# EAGLE design minisumo_v2 (EAGLE 9.4.2)
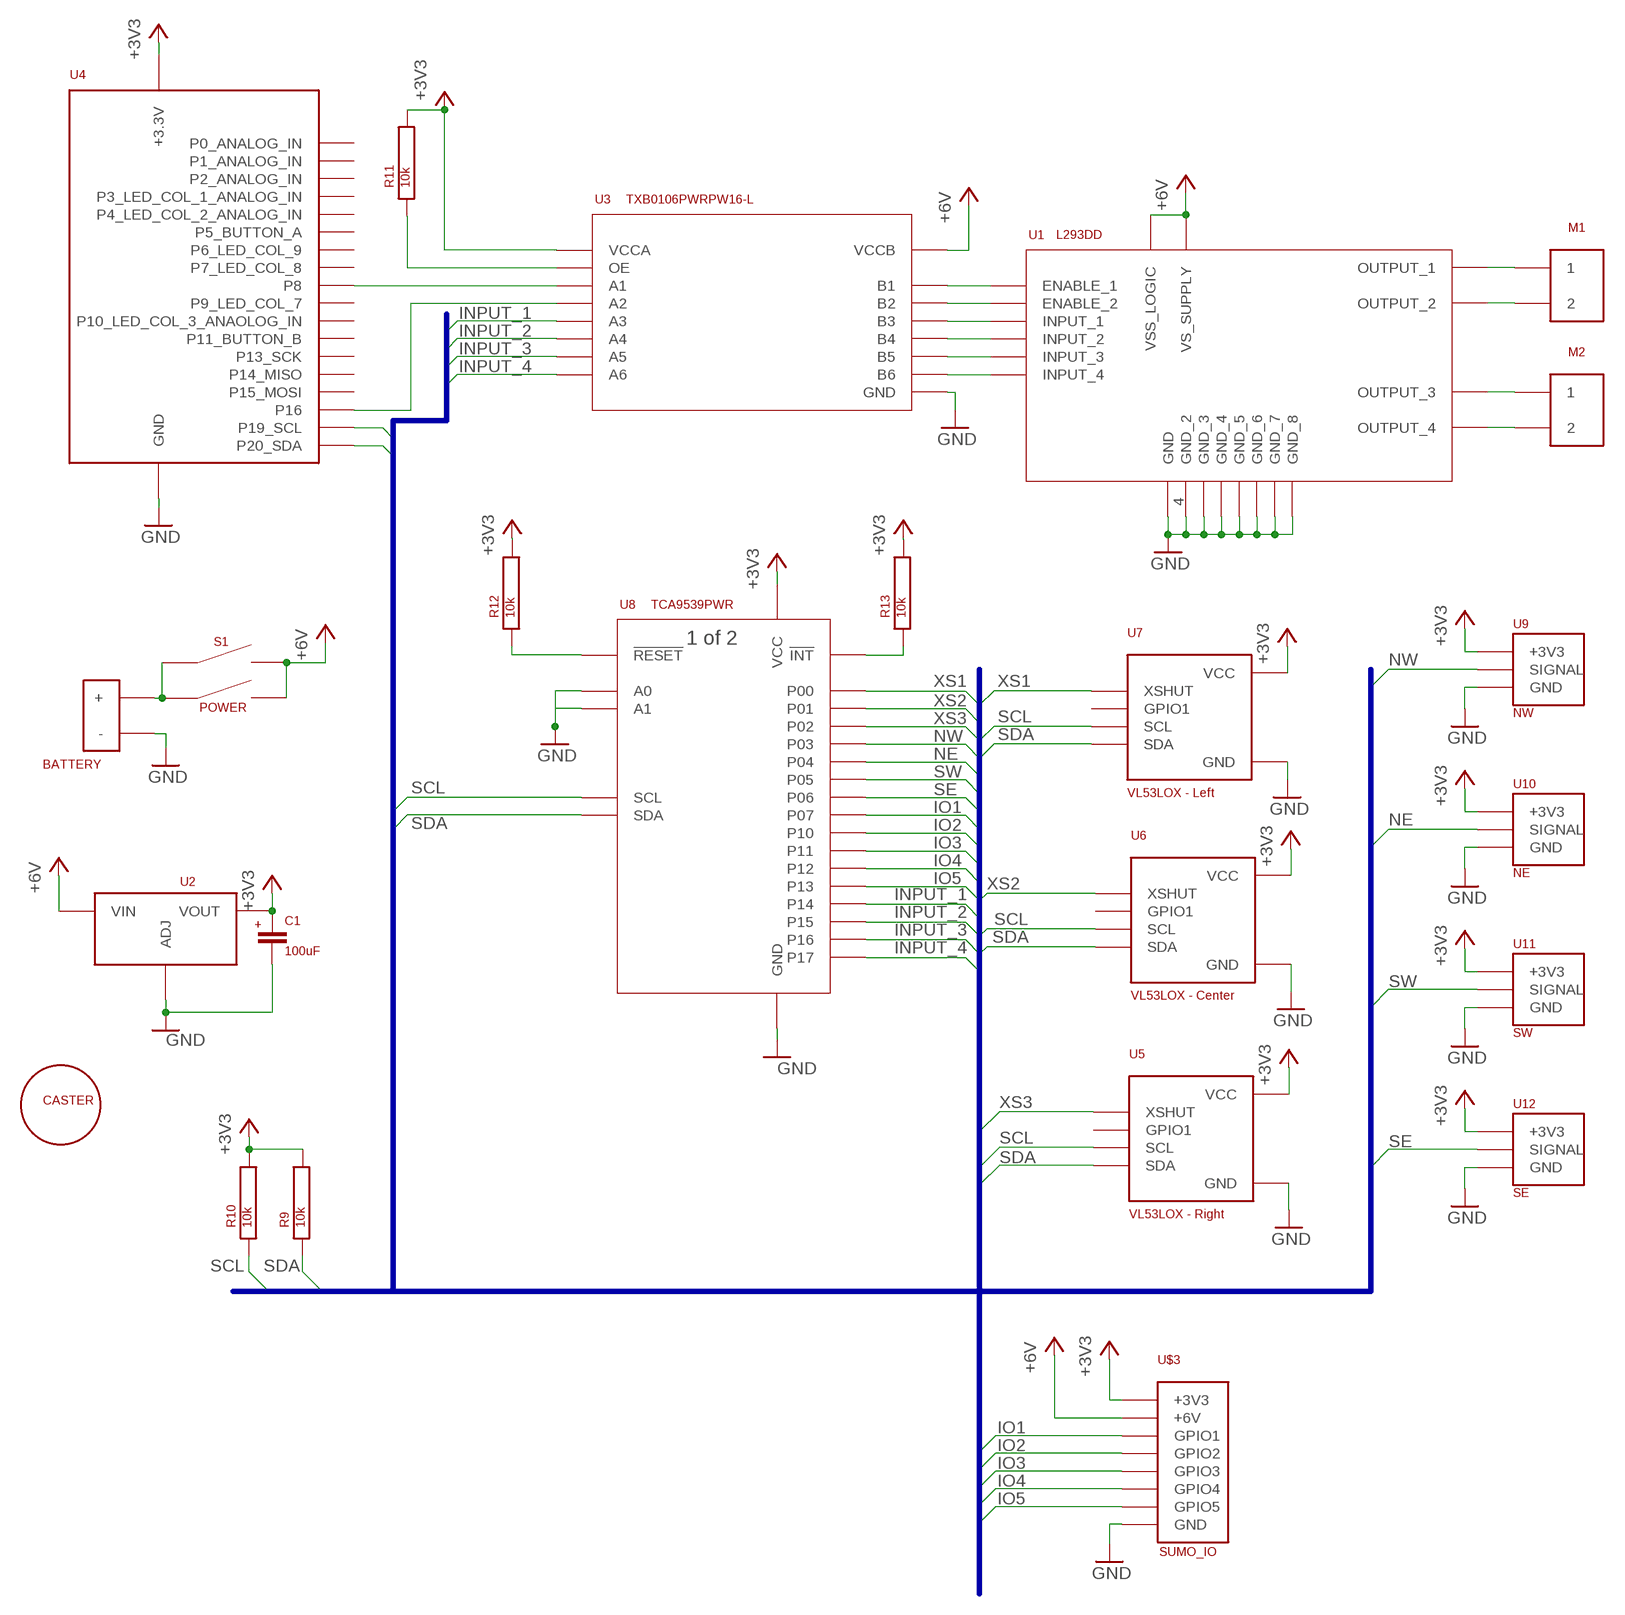
[diagram p0: schematic, sheet 1]

## Parts
BATTERY  BATTERY_HOLDER_AAA_2X2  [BATTERY_HOLDER_AAA_2X2]
C1  100uF  ELECTROLYTIC_CAPACITORWURTH_100  [ALUMINUM_WURTH_100UF_865080243007]
M1  N20_MOTOR  [N20-MOTOR-BRACKET]
M2  N20_MOTOR  [N20-MOTOR-BRACKET]
R9  10k  RESISTOR  [RES_0402]
R10  10k  RESISTOR  [RES_0402]
R11  10k  RESISTOR  [RES_0402]
R12  10k  RESISTOR  [RES_0402]
R13  10k  RESISTOR  [RES_0402]
S1  POWER  SWITCH_JS202011SCQN  [SWITCH_JS202011SCQN]
U1  L293DD  [SO-20]
U2  LM1117  [SOT-223]
U3  TXB0106PWRPW16-L  [PW16-L]
U4  BBC Micro:bit  MICRO_BIT  [CYCLONE_MICROBIT_VERTICAL]
U5  VL53LOX - Right  VL53LOX  [VL53LOX]
U6  VL53LOX - Center  VL53LOX  [VL53LOX]
U7  VL53LOX - Left  VL53LOX  [VL53LOX]
U8  TCA9539PWR  [24-TSSOP]
U9  NW  QRE1113_MODULE  [QRE1113_MODULE]
U10  NE  QRE1113_MODULE  [QRE1113_MODULE]
U11  SW  QRE1113_MODULE  [QRE1113_MODULE]
U12  SE  QRE1113_MODULE  [QRE1113_MODULE]
U$1  CASTER  [CASTER]
U$3  SUMO_IO  [SUMO_IO]

## Nets
+3V3: C1.+ R9.P$2 R10.P$2 R11.P$2 R12.P$2 R13.P$2 U2.P$2(VOUT) U2.VOUT$1(VOUT) U3.2(VCCA) U4.3.3V@9(+3.3V) U4.3.3V@10(+3.3V) U4.3.3V@11(+3.3V) U4.3.3V@12(+3.3V) U4.3.3V@13(+3.3V) U4.3.3V@14(+3.3V) U5.VCC U6.VCC U7.VCC U8.24(VCC) U9.+3V3 U10.+3V3 U11.+3V3 U12.+3V3 U$3.3V3(+3V3)
+5V: S1.3(B2) S1.6(B1) U1.10(VS_SUPPLY) U1.20(VSS_LOGIC) U2.VIN U3.15(VCCB) U$3.6V(+6V) ; supply symbol labelled +6V
GND: BATTERY.- C1.- U1.4(GND_2) U1.5(GND_3) U1.6(GND_4) U1.7(GND_5) U1.14(GND_6) U1.15(GND_7) U1.16(GND_8) U1.17(GND) U2.GND(ADJ) U3.9(GND) U4.GND@1(GND) U4.GND@2(GND) U4.GND@3(GND) U4.GND@4(GND) U4.GND@5(GND) U4.GND@6(GND) U5.GND U6.GND U7.GND U8.2(A1) U8.12(GND) U8.21(A0) U9.GND U10.GND U11.GND U12.GND U$3.GND
INPUT_1: U3.4(A3) U8.17(P14)
INPUT_2: U3.5(A4) U8.18(P15)
INPUT_3: U3.6(A5) U8.19(P16)
INPUT_4: U3.7(A6) U8.20(P17)
IO1: U8.11(P07) U$3.GPIO1
IO2: U8.13(P10) U$3.GPIO2
IO3: U8.14(P11) U$3.GPIO3
IO4: U8.15(P12) U$3.GPIO4
IO5: U8.16(P13) U$3.GPIO5
N$1: U1.1(ENABLE_1) U3.16(B1)
N$2: U1.11(ENABLE_2) U3.14(B2)
N$3: U1.2(INPUT_1) U3.13(B3)
N$4: U1.9(INPUT_2) U3.12(B4)
N$5: M1.1 U1.3(OUTPUT_1)
N$6: M1.2 U1.8(OUTPUT_2)
N$7: M2.1 U1.13(OUTPUT_3)
N$8: M2.2 U1.18(OUTPUT_4)
N$9: U3.1(A1) U4.P8
N$10: U1.12(INPUT_3) U3.11(B5)
N$11: U3.3(A2) U4.P16
N$12: U1.19(INPUT_4) U3.10(B6)
N$13: BATTERY.+ S1.2(A2) S1.5(A1)
N$14: R11.P$1 U3.8(OE)
N$16: R12.P$1 U8.3(!RESET)
N$17: R13.P$1 U8.1(!INT)
NE: U8.8(P04) U10.SIGNAL
NW: U8.7(P03) U9.SIGNAL
SCL: R10.P$1 U4.P21_SCL(P19_SCL) U5.SCL U6.SCL U7.SCL U8.22(SCL)
SDA: R9.P$1 U4.P20_SDA U5.SDA U6.SDA U7.SDA U8.23(SDA)
SE: U8.10(P06) U12.SIGNAL
SW: U8.9(P05) U11.SIGNAL
XS1: U7.XSHUT U8.4(P00)
XS2: U6.XSHUT U8.5(P01)
XS3: U5.XSHUT U8.6(P02)
Unconnected: U4.P0_ANALOG_IN@36(P0_ANALOG_IN) U4.P0_ANALOG_IN@37(P0_ANALOG_IN) U4.P0_ANALOG_IN@38(P0_ANALOG_IN) U4.P0_ANALOG_IN@39(P0_ANALOG_IN) U4.P1_ANALOG_IN@28(P1_ANALOG_IN) U4.P1_ANALOG_IN@29(P1_ANALOG_IN) U4.P1_ANALOG_IN@30(P1_ANALOG_IN) U4.P1_ANALOG_IN@31(P1_ANALOG_IN) U4.P2_ANALOG_IN@19(P2_ANALOG_IN) U4.P2_ANALOG_IN@20(P2_ANALOG_IN) U4.P2_ANALOG_IN@21(P2_ANALOG_IN) U4.P2_ANALOG_IN@22(P2_ANALOG_IN) U4.P3_LED_COL_1_ANALOG_IN U4.P4_LED_COL_2_ANALOG_IN U4.P5_BUTTON_A U4.P6_LED_COL_9 U4.P7_LED_COL8(P7_LED_COL_8) U4.P9_LED_COL_7 U4.P10_LED_COL_3_ANALOG_IN(P10_LED_COL_3_ANAOLOG_IN) U4.P11_BUTTON_B U4.P13_SCK U4.P14_MISO U4.P15_MOSI U5.GPIO1 U6.GPIO1 U7.GPIO1

## Buses
INPUT_1,INPUT_2,INPUT_3,INPUT_4,IO1,IO2,IO3,IO4,IO5,NE,NW,SCL,SDA,SE,SW,XS1,XS2,XS3

## Library data of the parts
BATTERY = TimeExpander2:BATTERY_HOLDER_AAA_2X2
C1 = TimeExpander2:ELECTROLYTIC_CAPACITOR
M1 M2 = TimeExpander2:N20_MOTOR
R9-R13 = TimeExpander2:RESISTOR
S1 = TimeExpander2:SWITCH_JS202011SCQN
U1 = TimeExpander2:L293DD; MANUFACTURER_PART_NUMBER: L293DD; VENDOR: STMicroelectronics
U2 = EE_copy:LM1117
U3 = TimeExpander2:TXB0106PWR; MANUFACTURER_PART_NUMBER: TXB0106PWR; VENDOR: Texas Instruments
U4 = TimeExpander2:MICRO_BIT
U5-U7 = TimeExpander2:VL53LOX
U8 = TimeExpander2:TCA9539PWR
U9-U12 = TimeExpander2:QRE1113_MODULE
U$1 = TimeExpander2:CASTER
U$3 = TimeExpander2:SUMO_IO

## Board
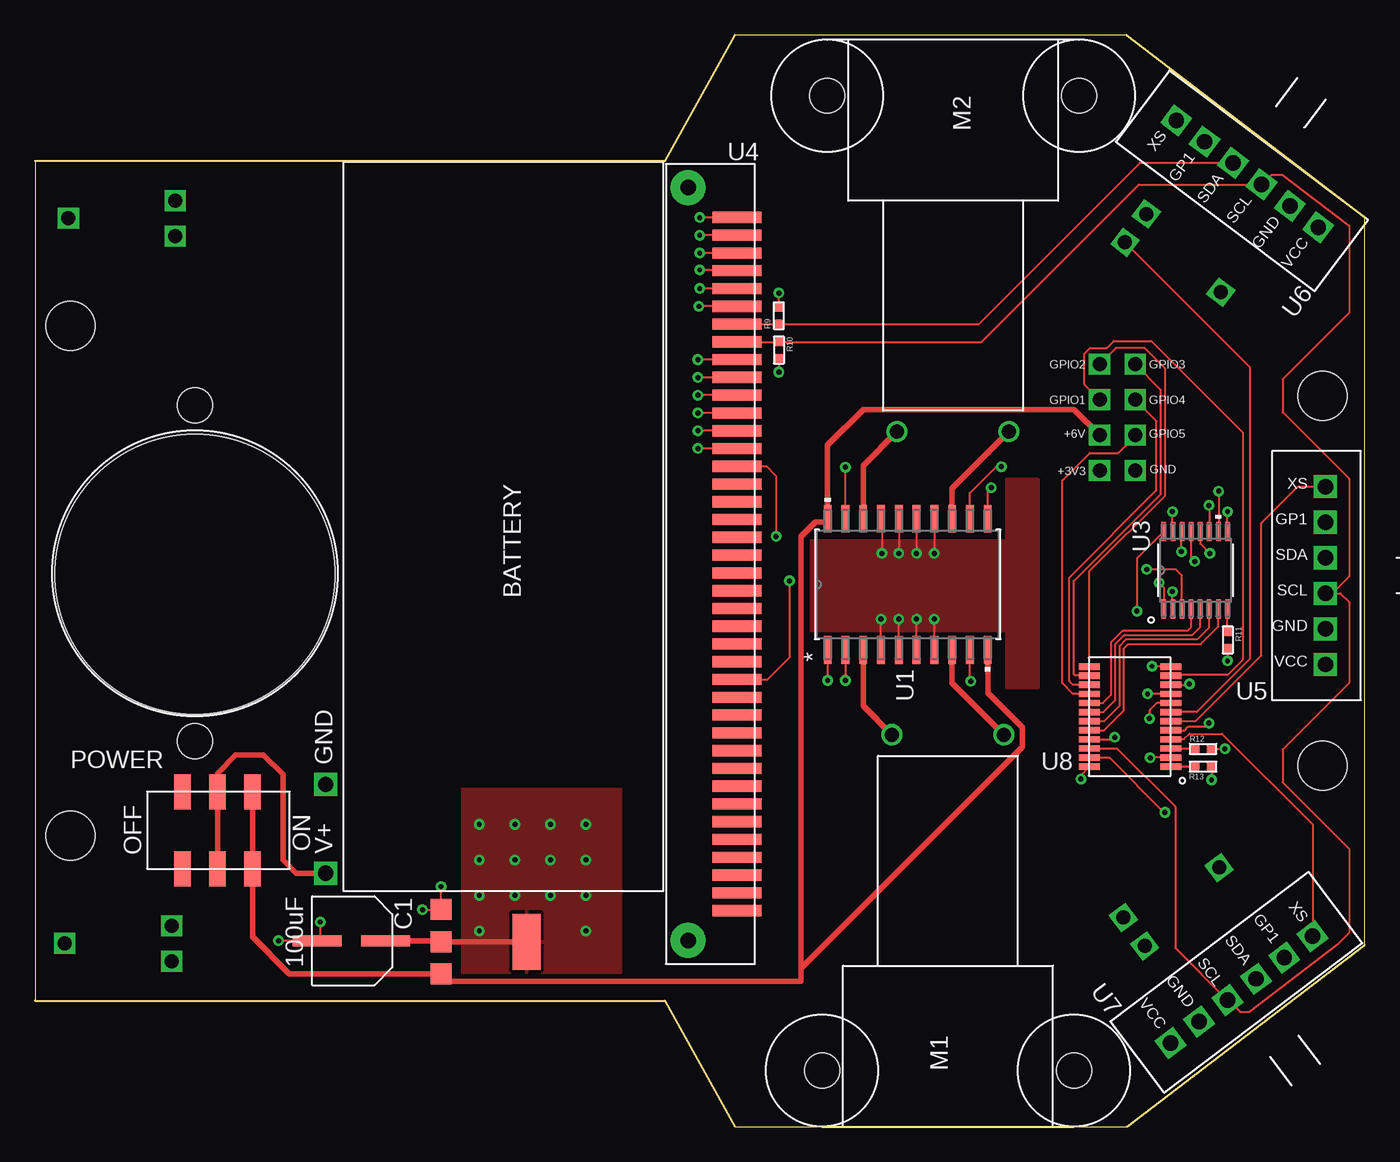
[diagram p1: board, top side]
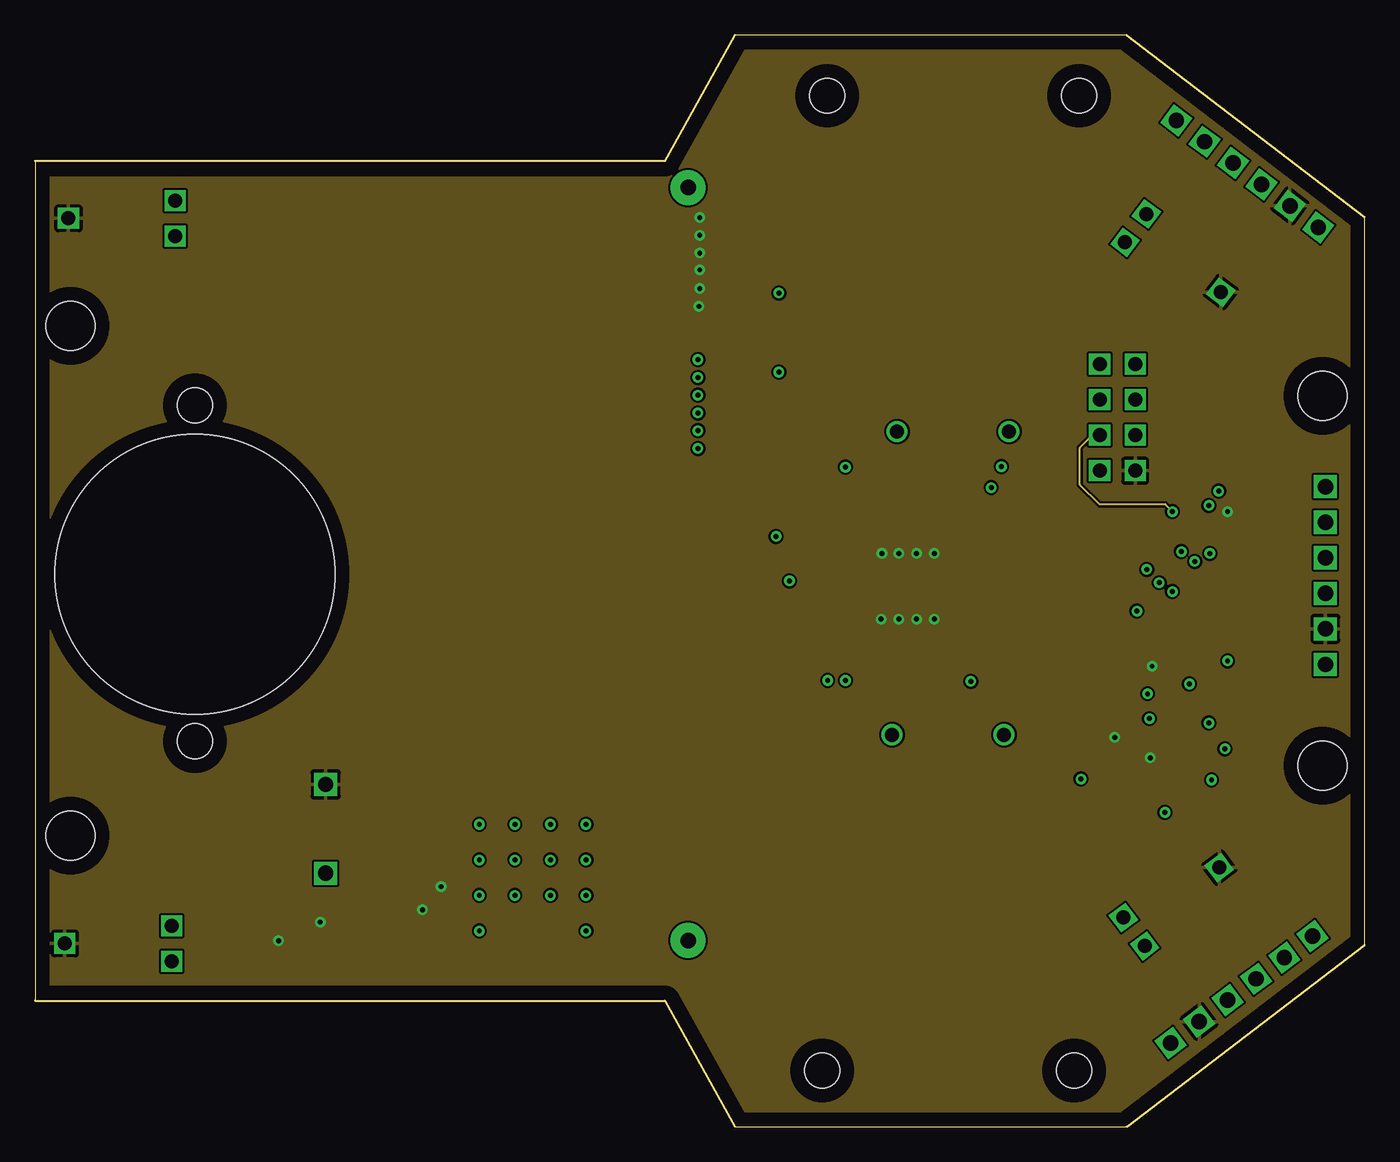
[diagram p2: board, inner layer L2_GND]
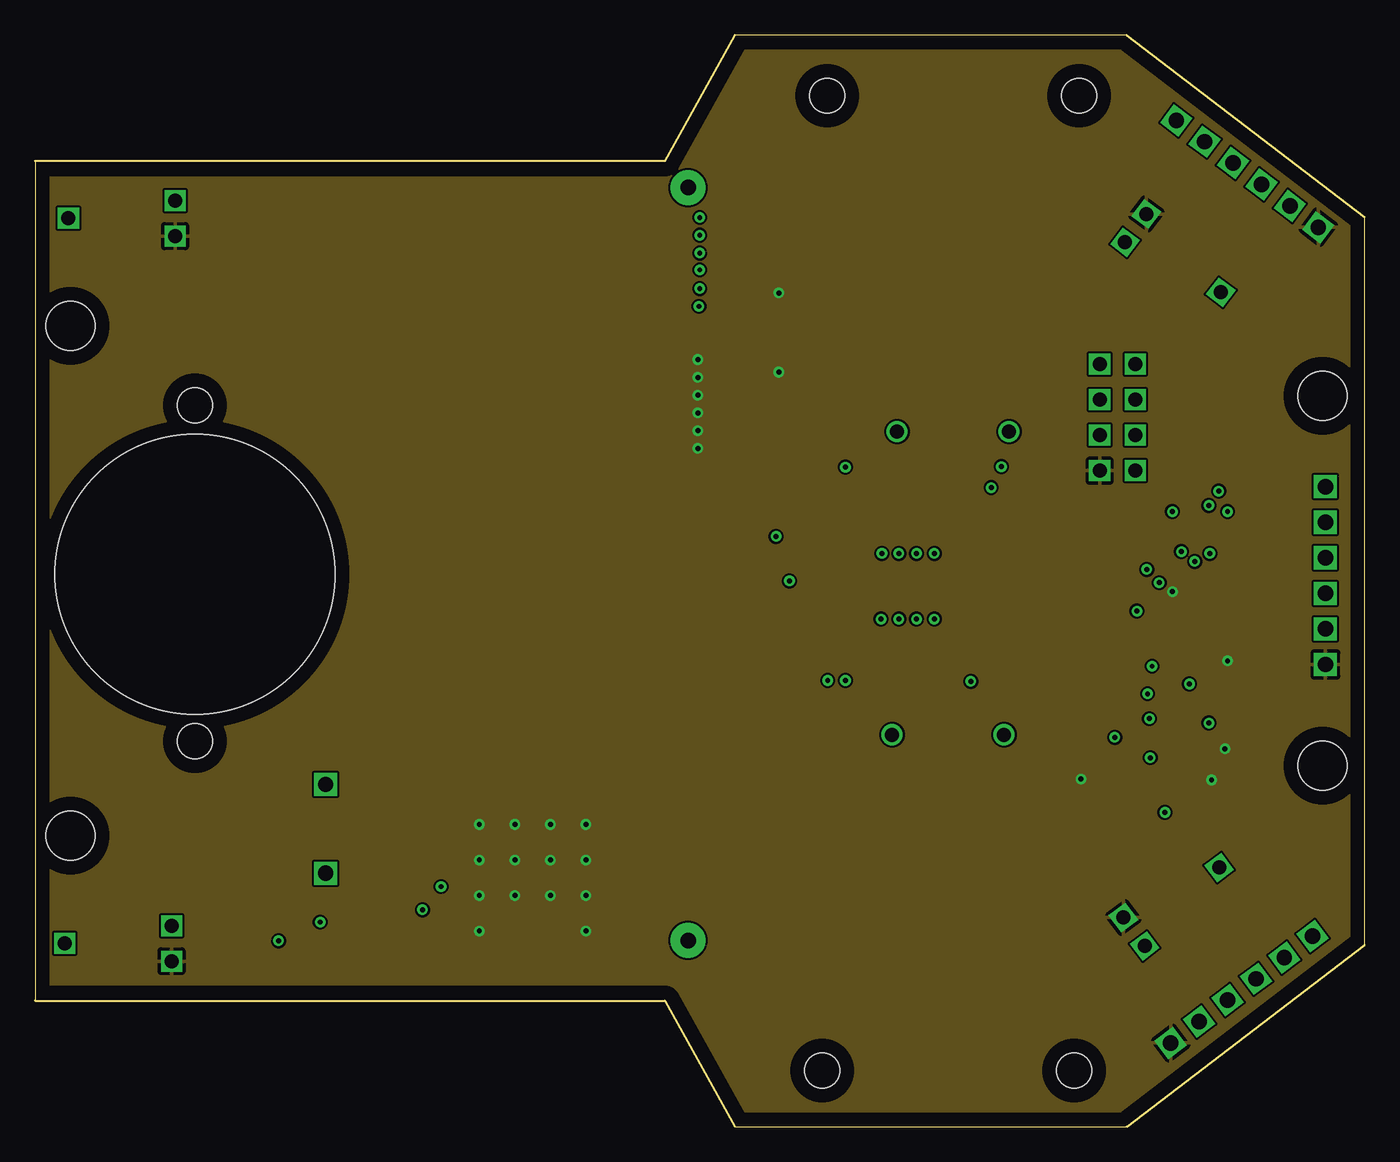
[diagram p3: board, inner layer L3_3V3]
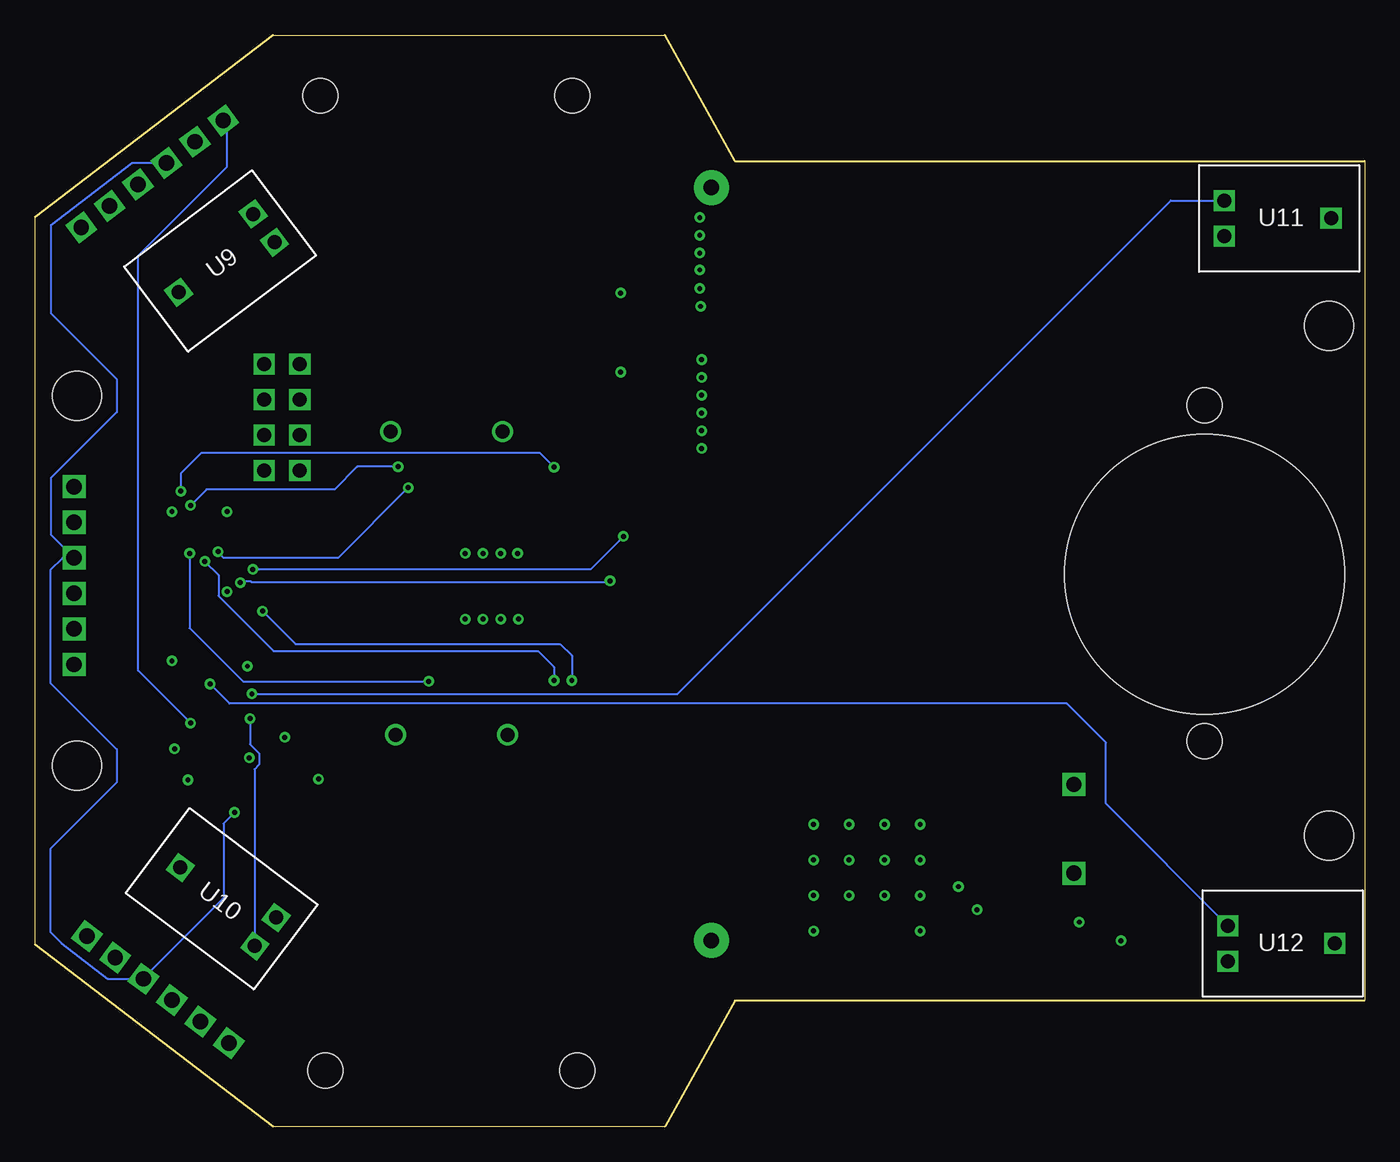
[diagram p4: board, bottom side, seen from below]

Size 95 x 78 mm. Coordinates in mm from the lower left corner, seen from the top.
Outline: 50,0 78,0 95,13 95,65 78,78 50,78 45,69 0,69 0,9 45,9 50,0
Copper layers (1+2*15+16): L1_TOP 0.035mm / dielectric 0.2mm / L2_GND 0.035mm / dielectric 0.15mm / L3_3V3 0.035mm / dielectric 0.2mm / L4_BOTTOM 0.035mm
Design rules "default *": minimum track width 6mil, minimum drill 0.35mm, track to track 6mil, track to pad 6mil, pad to pad 6mil, via to via 6mil, smd to smd 6mil, copper to edge 40mil, drill to drill 6mil, minimum pad ring 10mil, minimum via ring 8mil, stop-mask expansion 4mil, vias tented up to drill 15mil, thermal gap 10mil
Holes 3.5 mm at 2.54,57.22 2.54,20.78 92,52.22 92,25.78

### Footprints (pad centres in the part's own frame; a part is rotated, then mirrored left to right if it is on the bottom)
BATTERY_HOLDER_AAA_2X2 = drill 1.1 square: + 1.27,24.13; - 7.62,24.13
ALUMINUM_WURTH_100UF_865080243007 = smd 0.8 x 3.5: + 0,0.8; - 0,-4.1
N20-MOTOR-BRACKET = drill 1: 1 24,-5; 2 24,-13 | hole 2.5: 0,0; 0,-18
RES_0402 = smd 0.635 x 0.61: P$1 0,0; P$2 1.194,0
SWITCH_JS202011SCQN = smd 2.5 x 1.2: 1 0,0; 2 0,-2.5; 3 0,-5; 4 5.5,0; 5 5.5,-2.5; 6 5.5,-5
SO-20 = smd 1.981 x 0.559: 1 -4.686,5.715; 2 -4.686,4.445; 3 -4.686,3.175; 4 -4.686,1.905; 5 -4.686,0.635; 6 -4.686,-0.635; 7 -4.686,-1.905; 8 -4.686,-3.175; 9 -4.686,-4.445; 10 -4.686,-5.715; 11 4.686,-5.715; 12 4.686,-4.445; 13 4.686,-3.175; 14 4.686,-1.905; 15 4.686,-0.635; 16 4.686,0.635; 17 4.686,1.905; 18 4.686,3.175; 19 4.686,4.445; 20 4.686,5.715
SOT-223 = smd 1.5 x 1.5: GND -2.3,-6.1; P$2 0,-6.1; VIN 2.3,-6.1 | smd 4 x 2: VOUT$1 0,0
PW16-L = smd 1.365 x 0.325: 1 -2.769,2.275; 2 -2.769,1.625; 3 -2.769,0.975; 4 -2.769,0.325; 5 -2.769,-0.325; 6 -2.769,-0.975; 7 -2.769,-1.625; 8 -2.769,-2.275; 9 2.769,-2.275; 10 2.769,-1.625; 11 2.769,-0.975; 12 2.769,-0.325; 13 2.769,0.325; 14 2.769,0.975; 15 2.769,1.625; 16 2.769,2.275
CYCLONE_MICROBIT_VERTICAL = drill 1.1 pad 2.5: 1 -2.135,-3.5; 2 51.665,-3.5 | smd 0.8 x 3.5: 3.3V@9 10.16,0; 3.3V@10 11.43,0; 3.3V@11 12.7,0; 3.3V@12 13.97,0; 3.3V@13 15.24,0; 3.3V@14 16.51,0; GND@1 0,0; GND@2 1.27,0; GND@3 2.54,0; GND@4 3.81,0; GND@5 5.08,0; GND@6 6.35,0; P0_ANALOG_IN@36 44.45,0; P0_ANALOG_IN@37 45.72,0; P0_ANALOG_IN@38 46.99,0; P0_ANALOG_IN@39 48.26,0; P1_ANALOG_IN@28 34.29,0; P1_ANALOG_IN@29 35.56,0; P1_ANALOG_IN@30 36.83,0; P1_ANALOG_IN@31 38.1,0; P2_ANALOG_IN@19 22.86,0; P2_ANALOG_IN@20 24.13,0; P2_ANALOG_IN@21 25.4,0; P2_ANALOG_IN@22 26.67,0; P3_LED_COL_1_ANALOG_IN 49.53,0; P4_LED_COL_2_ANALOG_IN 43.18,0; P5_BUTTON_A 41.91,0; P6_LED_COL_9 40.64,0; P7_LED_COL8 39.37,0; P8 33.02,0; P9_LED_COL_7 31.75,0; P10_LED_COL_3_ANALOG_IN 30.48,0; P11_BUTTON_B 29.21,0; P13_SCK 21.59,0; P14_MISO 20.32,0; P15_MOSI 19.05,0; P16 17.78,0; P20_SDA 7.62,0; P21_SCL 8.89,0; RESERVED 27.94,0
VL53LOX = drill 1.1 square: GND 0,-2.54; GPIO1 0,-10.16; SCL 0,-5.08; SDA 0,-7.62; VCC 0,0; XSHUT 0,-12.7
24-TSSOP = smd 1.5 x 0.45: 1 0,0; 2 0,-0.65; 3 0,-1.3; 4 0,-1.95; 5 0,-2.6; 6 0,-3.25; 7 0,-3.9; 8 0,-4.55; 9 0,-5.2; 10 0,-5.85; 11 0,-6.5; 12 0,-7.15; 13 5.8,-7.15; 14 5.8,-6.5; 15 5.8,-5.85; 16 5.8,-5.2; 17 5.8,-4.55; 18 5.8,-3.9; 19 5.8,-3.25; 20 5.8,-2.6; 21 5.8,-1.95; 22 5.8,-1.3; 23 5.8,-0.65; 24 5.8,0
QRE1113_MODULE = drill 1 square: +3V3 1.8,2.54; GND 9.42,3.81; SIGNAL 1.8,5.08
CASTER = hole 2.5: 0,2; 0,-22 | hole 20: 0,-10.08
SUMO_IO = drill 1 square: 3V3 0,0; 6V 2.54,0; GND 0,-2.54; GPIO1 5.08,0; GPIO2 7.62,0; GPIO3 7.62,-2.54; GPIO4 5.08,-2.54; GPIO5 2.54,-2.54

### Placement (x,y rotation side)
BATTERY  44.89,16.83 90 top
C1  24.26,13.27 270 top
M1  56.24,4 90 top
M2  74.6,73.66 270 top
R9  53.15,57.34 90 top
R10  53.15,56.07 270 top
R11  85.22,35.37 270 top
R12  82.87,26.99 0 top
R13  82.87,25.72 0 top
S1  10.54,18.41 90 top
U1  62.36,38.73 90 top
U2  35.12,13.21 270 top
U3  82.93,39.75 90 top
U4  50.16,64.96 270 top
U5  92.2,33.02 180 top
U6  91.69,64.26 233 top
U7  81.15,5.97 127 top
U8  81.15,25.72 180 top
U9  79.5,68.33 217 bottom
U10  74.8,15.88 143 bottom
U11  11.81,61.09 0 bottom
U12  11.56,9.27 0 bottom
U$1  11.43,49.53 0 top
U$3  76.07,46.86 90 top

### Tracks (layer width: path | path; a pad name or v marks a point on that pad's centre or on a via)
+3V3  (via drill 0.35)
  L1_TOP 0.152: U3.2 81.28,37.01 v81.28,38.23 | U4.3.3V@9 v47.37,54.8 | U4.3.3V@10 v47.37,53.53 | U4.3.3V@11 v47.37,52.26 | U4.3.3V@12 v47.37,50.99 | U4.3.3V@13 v47.37,49.72 | U4.3.3V@14 v47.37,48.45 | 28.95,13.27 U2.P$2 | R9.P$2 v53.15,59.56 | R10.P$2 v53.15,53.91 | R11.P$2 v85.22,33.27 | R12.P$2 v85.03,26.99 | R13.P$2 84.07,25.7 v84.07,24.77 | U8.24 74.74,25.1 v74.74,24.83
  L1_TOP 0.4: U2.P$2 U2.VOUT$1 | 28.95,13.27 C1.+
  other vias: 31.75,21.59 31.75,19.05 31.75,16.51 31.75,13.97 34.29,21.59 34.29,19.05 34.29,16.51 36.83,21.59 36.83,19.05 36.83,16.51 39.37,21.59 39.37,19.05 39.37,16.51 39.37,13.97
  pour L3_3V3: 0,8.89 45.09,8.89 50.04,-0.13 78.11,0 95,12.95 95,65.15 77.98,77.98 49.91,77.98 44.96,69.09 0.13,68.96
  pour L1_TOP: 30.48,10.99 41.91,10.99 41.91,24.13 30.48,24.13
+5V  (via drill 0.35)
  L1_TOP 0.152: U2.VIN 29.54,10.38 | U1.20 56.4,43.18 | U3.15 81.28,42.55 v81.28,43.94 | 54.74,10.38 54.61,10.38 | 54.74,11.43 54.74,11.37
  L1_TOP 0.4: S1.6 S1.3 15.54,13.54 18.18,10.91 U2.VIN | 29.54,10.38 54.61,10.38 | U1.10 68.07,30.99 70.55,28.51 70.55,27.11 54.8,11.37 54.74,11.37 54.74,10.38 | 56.4,43.18 55.75,43.18 54.74,42.16 54.74,11.43 | U$3.6V 74.23,51.24 59.18,51.24 56.64,48.7 U1.20
  L2_GND 0.152: v81.28,43.94 80.77,44.45 76.07,44.45 74.68,45.85 74.68,48.51 75.56,49.4 U$3.6V
GND  (via drill 0.35)
  L1_TOP 0.152: U3.9 85.21,43.93 v85.22,43.94 | U1.14 v64.26,40.96 | U1.7 v64.26,36.26 | U1.6 v62.99,36.26 | U1.5 v61.72,36.26 | U1.4 v60.45,36.26 | U1.15 v62.99,40.96 | U1.16 v61.72,40.96 | U1.17 60.52,43.36 v60.52,40.96 | U4.GND@1 v47.5,64.96 | U4.GND@2 v47.5,63.69 | U4.GND@3 v47.5,62.42 | U4.GND@4 50.1,61.21 v47.5,61.21 | U4.GND@5 v47.5,59.88 | U4.GND@6 v47.43,58.61 | v29.02,17.14 U2.GND 29,15.49 v27.69,15.49 | v17.4,13.27 C1.- 20.38,13.5 v20.38,14.61 | U8.12 79.84,32.87 v79.82,32.89 | U8.2 79.71,26.37 v79.69,26.35 | U8.21 77.01,27.67 v77.15,27.81
  pour L2_GND: 0.13,9.02 44.96,9.02 50.04,-0.13 77.98,-0.13 95,13.08 95.12,64.9 77.98,78.11 49.78,78.11 44.96,69.09 0,69.09 0,8.89
  pour L1_TOP: 55.44,41.91 69.41,41.91 69.41,46.29 71.69,46.29 71.69,31.31 69.41,31.31 69.41,35.37 55.44,35.37
INPUT_1
  L1_TOP 0.152: U8.17 76.31,30.27 76.9,30.86 76.9,34.61 77.72,35.43 82.36,35.43 82.61,35.69 U3.4
INPUT_2
  L1_TOP 0.152: U8.18 76.35,29.62 77.2,30.47 77.2,34.48 77.85,35.13 82.69,35.13 83.26,35.69 U3.5
INPUT_3
  L1_TOP 0.152: U8.19 76.39,28.97 77.51,30.09 77.51,34.35 77.98,34.82 83.08,34.82 83.91,35.65 U3.6
INPUT_4
  L1_TOP 0.152: U8.20 76.39,28.32 77.81,29.74 77.81,34.16 78.13,34.48 83.31,34.48 84.56,35.72 U3.7
IO1
  L1_TOP 0.152: U$3.GPIO1 74.99,53.02 74.99,55.24 75.39,55.64 76.58,55.64 77.07,56.13 79.76,56.13 86.3,49.59 86.3,33.34 85.22,32.26 81.19,32.26 U8.11
IO2
  L1_TOP 0.152: U8.13 75.35,39.68 80.76,45.09 80.76,54.17 79.3,55.63 77.22,55.63 U$3.GPIO2
IO3
  L1_TOP 0.152: U8.14 74.33,32.22 74.23,32.32 74.23,38.99 80.45,45.21 80.45,52.64 U$3.GPIO3
IO4
  L1_TOP 0.152: U8.15 74.16,31.57 73.91,31.81 73.91,39.24 80.14,45.47 80.14,50.42 U$3.GPIO4
IO5
  L1_TOP 0.152: U8.16 74.17,30.92 73.41,31.69 73.41,46.16 75.37,48.13 77.41,48.13 78.61,49.34 U$3.GPIO5
N$1  (via drill 0.35)
  L1_TOP 0.152: U1.1 v56.64,31.88 | U3.16 78.74,40.6 v78.74,36.83
  L4_BOTTOM 0.152: v78.74,36.83 76.39,34.48 57.47,34.48 56.64,33.66 v56.64,31.88
N$2  (via drill 0.35)
  L1_TOP 0.152: U1.11 68.07,45.4 v68.33,45.66 | v81.92,41.08 81.92,42.48 U3.14
  L4_BOTTOM 0.152: v68.33,45.66 73.34,40.64 81.53,40.64 81.92,41.02 v81.92,41.08
N$3  (via drill 0.35)
  L1_TOP 0.152: U1.2 v57.91,31.88 | U3.13 82.61,40.65 v82.87,40.39
  L4_BOTTOM 0.152: v82.87,40.39 81.89,39.41 81.89,37.91 77.95,33.97 59.05,33.97 57.91,32.83 v57.91,31.88
N$4  (via drill 0.35)
  L1_TOP 0.152: U3.12 83.26,41.65 v83.95,40.96 | v66.86,31.81 66.8,31.88 U1.9
  L4_BOTTOM 0.152: v83.95,40.96 83.95,35.62 80.14,31.81 v66.86,31.81
N$5
  L1_TOP 0.4: U1.3 59.18,30.06 M1.1
N$6
  L1_TOP 0.4: U1.8 65.53,31.71 M1.2
N$7
  L1_TOP 0.4: U1.13 65.53,45.59 M2.1
N$8
  L1_TOP 0.4: U1.18 59.18,47.24 M2.2
N$9  (via drill 0.35)
  L1_TOP 0.152: v53.91,38.99 53.91,33.53 52.32,31.94 U4.P8 | v80.33,38.86 80.66,38.53 U3.1
  L4_BOTTOM 0.152: v53.91,38.99 53.98,38.92 79.55,38.92 79.56,38.93 80.26,38.93 v80.33,38.86
N$10  (via drill 0.35)
  L1_TOP 0.152: v69.06,47.15 68.87,47.34 66.8,45.28 U1.12 | v83.88,44.39 83.91,44.36 U3.11
  L4_BOTTOM 0.152: v69.06,47.15 71.98,47.15 73.6,45.53 82.74,45.53 v83.88,44.39
N$11  (via drill 0.35)
  L1_TOP 0.152: U3.3 81.96,39.39 81.53,39.81 v79.44,39.81 | U4.P16 52.26,47.18 52.96,46.48 v52.96,42.16
  L4_BOTTOM 0.152: v52.96,42.16 55.31,39.81 v79.44,39.81
N$12  (via drill 0.35)
  L1_TOP 0.152: U1.19 v57.91,47.12 | v84.58,45.4 84.58,42.55 U3.10
  L4_BOTTOM 0.152: v57.91,47.12 58.93,48.13 83.12,48.13 84.58,46.67 v84.58,45.4
N$13
  L1_TOP 0.4: BATTERY.+ 18.67,18.1 17.72,19.05 17.72,25.15 16.32,26.54 14.35,26.54 13.04,25.23 S1.5 S1.2
N$14
  L1_TOP 0.152: R11.P$1 85.21,35.38 U3.8
N$16
  L1_TOP 0.152: U8.3 82.84,27.02 R12.P$1
N$17
  L1_TOP 0.152: U8.1 R13.P$1
NE  (via drill 0.35)
  L1_TOP 0.152: U8.8 80.18,30.27 79.63,29.72 v79.63,29.15
  L4_BOTTOM 0.152: v79.63,29.15 79.63,27.3 78.99,26.67 78.99,25.86 79.32,25.53 79.32,12.92 U10.SIGNAL
NW
  L1_TOP 0.152: U9.SIGNAL 86.81,54.26 86.81,33.41 83.01,29.62 U8.7
SCL
  L1_TOP 0.152: U4.P21_SCL R10.P$1 67.62,56.07 78.87,67.32 U6.SCL 87.7,67.32 88.39,68.01 89.14,68.01 93.91,64.36 93.91,58.15 89.16,53.4 89.16,51.04 93.91,46.29 93.91,39.31 92.7,38.1 U5.SCL 93.28,38.1 93.91,37.47 93.91,31.71 89.16,26.96 89.16,24.6 93.91,19.85 93.91,13.84 93.06,12.99 86.79,8.19 86.11,8.19 85.34,8.96 85.27,8.96 U7.SCL 81.47,12.77 81.47,22.86 77.31,27.02 U8.22
SDA  (via drill 0.35)
  L1_TOP 0.152: U4.P20_SDA R9.P$1 67.44,57.34 78.94,68.85 U6.SDA | U8.23 76.76,26.37 80.71,22.42 v80.74,22.45
  L4_BOTTOM 0.152: U6.SDA 88.05,68.85 93.87,64.39 93.87,58.11 89.16,53.4 89.16,51.04 93.87,46.33 93.87,42.31 U5.SDA 93.03,40.64 93.91,39.76 93.91,31.71 89.16,26.96 89.16,24.6 93.91,19.85 93.91,13.9 93.09,13.08 89.79,10.55 87.31,10.55 | 87.31,10.55 U7.SDA | v80.74,22.45 81.53,21.65 81.53,16.33 87.31,10.55
SE  (via drill 0.35)
  L1_TOP 0.152: U8.10 82.35,31.57 82.36,31.56 82.42,31.56 v82.49,31.62
  L4_BOTTOM 0.152: U12.SIGNAL 18.48,23.07 18.48,27.43 21.27,30.23 81.09,30.23 v82.49,31.62
SW  (via drill 0.35)
  L1_TOP 0.152: U8.9 v79.51,30.92 v79.5,30.92
  L4_BOTTOM 0.152: v79.5,30.92 49.09,30.92 13.84,66.17 U11.SIGNAL
XS1
  L1_TOP 0.152: U8.4 81.17,27.69 82.11,27.69 82.49,28.07 84.82,28.07 91.3,21.59 U7.XSHUT
XS2  (via drill 0.35)
  L1_TOP 0.152: U8.5 82.17,28.32 82.42,28.57 83.63,28.57 v83.88,28.83
  L4_BOTTOM 0.152: v83.88,28.83 87.63,32.58 87.63,62.23 81.28,68.58 81.28,71.63 U6.XSHUT
XS3
  L1_TOP 0.152: U8.6 82.94,28.97 87.63,33.66 87.63,43.12 90.23,45.72 U5.XSHUT